# EAGLE design untitled (EAGLE 6.3)
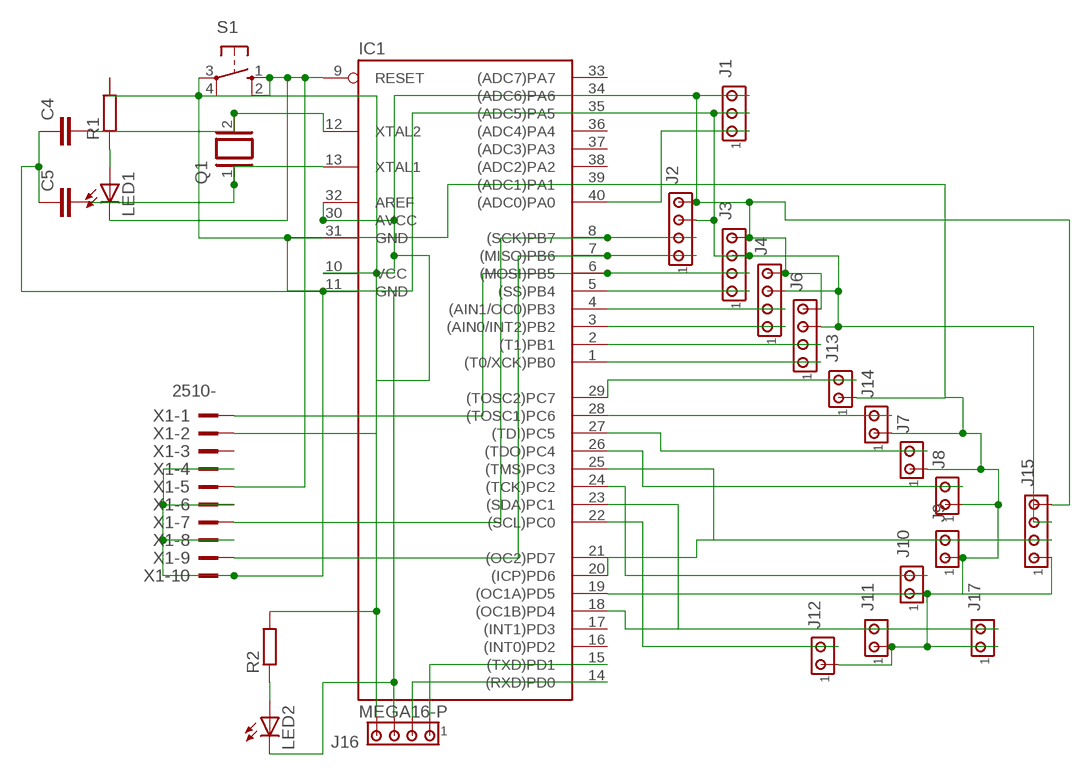
[diagram p0: schematic, sheet 1]

## Parts
C4  C2.5/2  [C2.5-2]
C5  C2.5/2  [C2.5-2]
IC1  MEGA16-P  [DIL40]
J1  MTA03-100  [10X03MTA]
J2  MTA04-100  [10X04MTA]
J3  MTA04-100  [10X04MTA]
J4  MTA04-100  [10X04MTA]
J6  MTA04-100  [10X04MTA]
J7  MTA02-100  [10X02MTA]
J8  MTA02-100  [10X02MTA]
J9  MTA02-100  [10X02MTA]
J10  MTA02-100  [10X02MTA]
J11  MTA02-100  [10X02MTA]
J12  MTA02-100  [10X02MTA]
J13  MTA02-100  [10X02MTA]
J14  MTA02-100  [10X02MTA]
J15  MTA04-100  [10X04MTA]
J16  MTA04-100  [10X04MTA]
J17  MTA02-100  [10X02MTA]
LED1  LEDSFH482  [SFH482]
LED2  LEDSFH482  [SFH482]
Q1  XTAL/S  [QS]
R1  R-EU_0207/10  [0207/10]
R2  R-EU_0207/10  [0207/10]
S1  10-XX  [B3F-10XX]
X1  2510-  [PAK100/2500-10]

## Nets
N$1: IC1.29((TOSC2)PC7) J13.2
N$2: IC1.9(RESET) LED1.K(C) S1.1(S) S1.2(S1) X1.5
N$3: IC1.40((ADC0)PA0) J1.1
N$4: IC1.1((T0/XCK)PB0) J6.1
N$5: IC1.2((T1)PB1) J6.2
N$6: IC1.3((AIN0/INT2)PB2) J4.1
N$7: IC1.4((AIN1/OC0)PB3) J4.2
N$8: IC1.5((SS)PB4) J3.1
N$9: IC1.6((MOSI)PB5) J3.2 X1.1
N$10: IC1.7((MISO)PB6) J2.1 X1.9
N$11: IC1.8((SCK)PB7) J2.2 X1.7
N$12: IC1.10(VCC) IC1.30(AVCC) IC1.32(AREF) J1.3 J2.4 J3.4 J4.4 J6.4 J15.4 J16.4 R1.2 R2.2 X1.2
N$14: IC1.28((TOSC1)PC6) J14.2
N$15: IC1.27((TDI)PC5) J7.2
N$16: IC1.26((TDO)PC4) J8.2
N$17: IC1.25((TMS)PC3) J9.2
N$18: IC1.24((TCK)PC2) J10.2
N$19: IC1.23((SDA)PC1) J11.2
N$20: IC1.22((SCL)PC0) J12.2
N$21: LED2.A R2.1
N$22: IC1.19((OC1A)PD5) J15.1
N$23: IC1.15((TXD)PD1) J16.1
N$26: IC1.20((ICP)PD6) J15.2
N$34: IC1.14((RXD)PD0) J16.2
N$39: LED1.A R1.1
N$46: C5.2 IC1.13(XTAL1) Q1.1
N$47: C4.2 IC1.12(XTAL2) Q1.2
N$48: C4.1 C5.1 IC1.11(GND) IC1.31(GND) J1.2 J2.3 J3.3 J4.3 J6.3 J7.1 J8.1 J9.1 J10.1 J11.1 J12.1 J13.1 J14.1 J15.3 J16.3 J17.1 LED2.K(C) S1.3(P) S1.4(P1) X1.4 X1.6 X1.8 X1.10
N$59: IC1.18((OC1B)PD4) J17.2
Unconnected: IC1.16((INT0)PD2) IC1.17((INT1)PD3) IC1.21((OC2)PD7) IC1.33((ADC7)PA7) IC1.34((ADC6)PA6) IC1.35((ADC5)PA5) IC1.36((ADC4)PA4) IC1.37((ADC3)PA3) IC1.38((ADC2)PA2) IC1.39((ADC1)PA1) X1.3

## Library data of the parts
C4 C5 = capacitor-wima:C: CAPACITOR naming: grid - package width
IC1 = atmel:MEGA16-P: MICROCONTROLLER 16 Kbytes FLASH 1 kbytes SRAM 512 bytes EEPROM USART 8-channel 10 bit ADC Source: avr.lbr; MPN: ATMEGA16-16PU; OC_FARNELL: 9171142; OC_NEWARK: 01M6885
J1 = con-amp:MTA03-100: AMP connector
J2-J4 J6 J15 J16 = con-amp:MTA04-100: AMP connector
J7-J14 J17 = con-amp:MTA02-100: AMP connector
LED1 LED2 = adafruit:LED: LED OSRAM: - CHIPLED LG R971, LG N971, LY N971, LG Q971, LY Q971, LO R971, LY R971 LH N974, LH R974 LS Q976, LO Q976, LY Q976 LO Q996 - Hyper CHIPLED LW Q18S LB Q993, LB Q99A, LB R99A - SideLED LS A670, LO A670, LY A670, LG A670, LP A670 LB A673, LV A673, LT A673, LW A673 LH A674 LY A675 LS A676, LA A676, LO A676, LY A676, LW A676 LS A679, LY A679, LG A679 - Hyper Micro SIDELED® LS Y876, LA Y876, LO Y876, LY Y876 LT Y87S - SmartLED LW L88C, LW L88S LB L89C, LB L89S, LG L890 LS L89K, LO L89K, LY L89K LS L896, LA L896, LO L896, LY L896 - TOPLED LS T670, LO T670, LY T670, LG T670, LP T670 LSG T670, LSP T670, LSY T670, LOP T670, LYG T670 LG T671, LOG T671, LSG T671 LB T673, LV T673, LT T673, LW T673 LH T674 LS T676, LA T676, LO T676, LY T676, LB T676, LH T676, LSB T676, LW T676 LB T67C, LV T67C, LT T67C, LS T67K, LO T67K, LY T67K, LW E67C LS E67B, LA E67B, LO E67B, LY E67B, LB E67C, LV E67C, LT E67C LW T67C LS T679, LY T679, LG T679 LS T770, LO T770, LY T770, LG T770, LP T770 LB T773, LV T773, LT T773, LW T773 LH T774 LS E675, LA E675, LY E675, LS T675 LS T776, LA T776, LO T776, LY T776, LB T776 LHGB T686 LT T68C, LB T68C - Hyper Mini TOPLED® LB M676 - Mini TOPLED Santana® LG M470 LS M47K, LO M47K, LY M47K Source: http://www.osram.convergy.de/
Q1 = special:XTAL/S: CRYSTAL
R1 R2 = rcl:R-EU_: RESISTOR, European symbol
S1 = switch-omron:10-XX: OMRON SWITCH; MPN: B3F-1000; OC_FARNELL: 176432; OC_NEWARK: 36M3542
X1 = con-3m:2510-: 3M (TM) Pak 100 4-Wall Header Source: 3M; MF: 3M; MPN: 2510-6002UB; OC_FARNELL: 9838244; OC_NEWARK: 46F4725

## Board
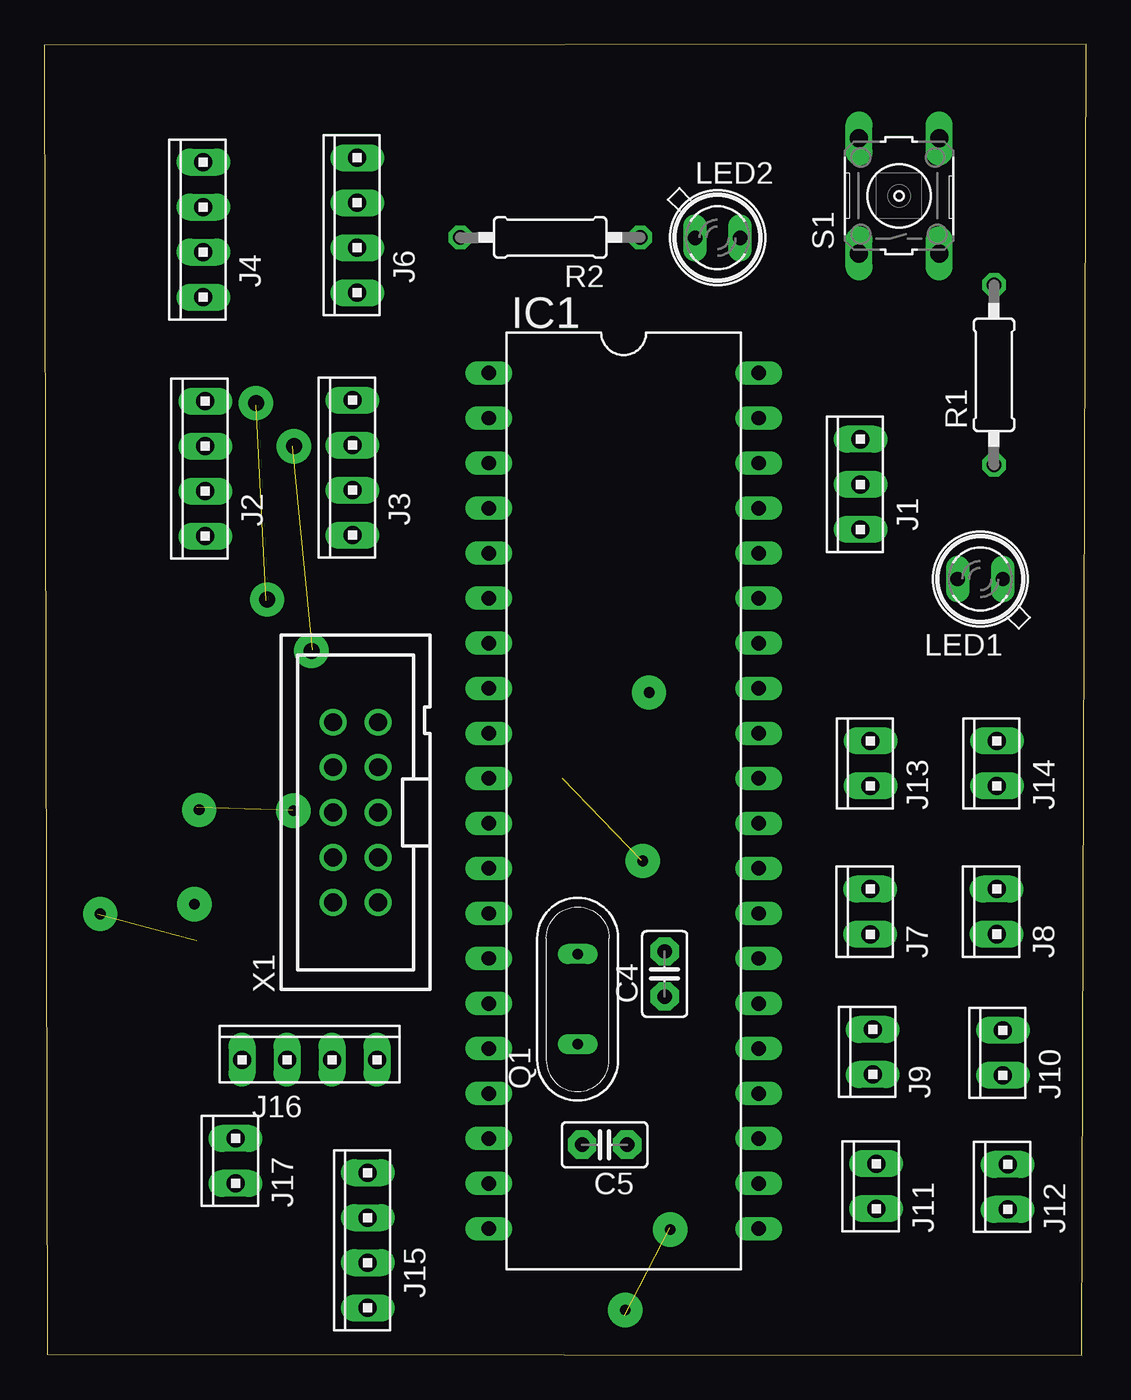
[diagram p1: board, top side]
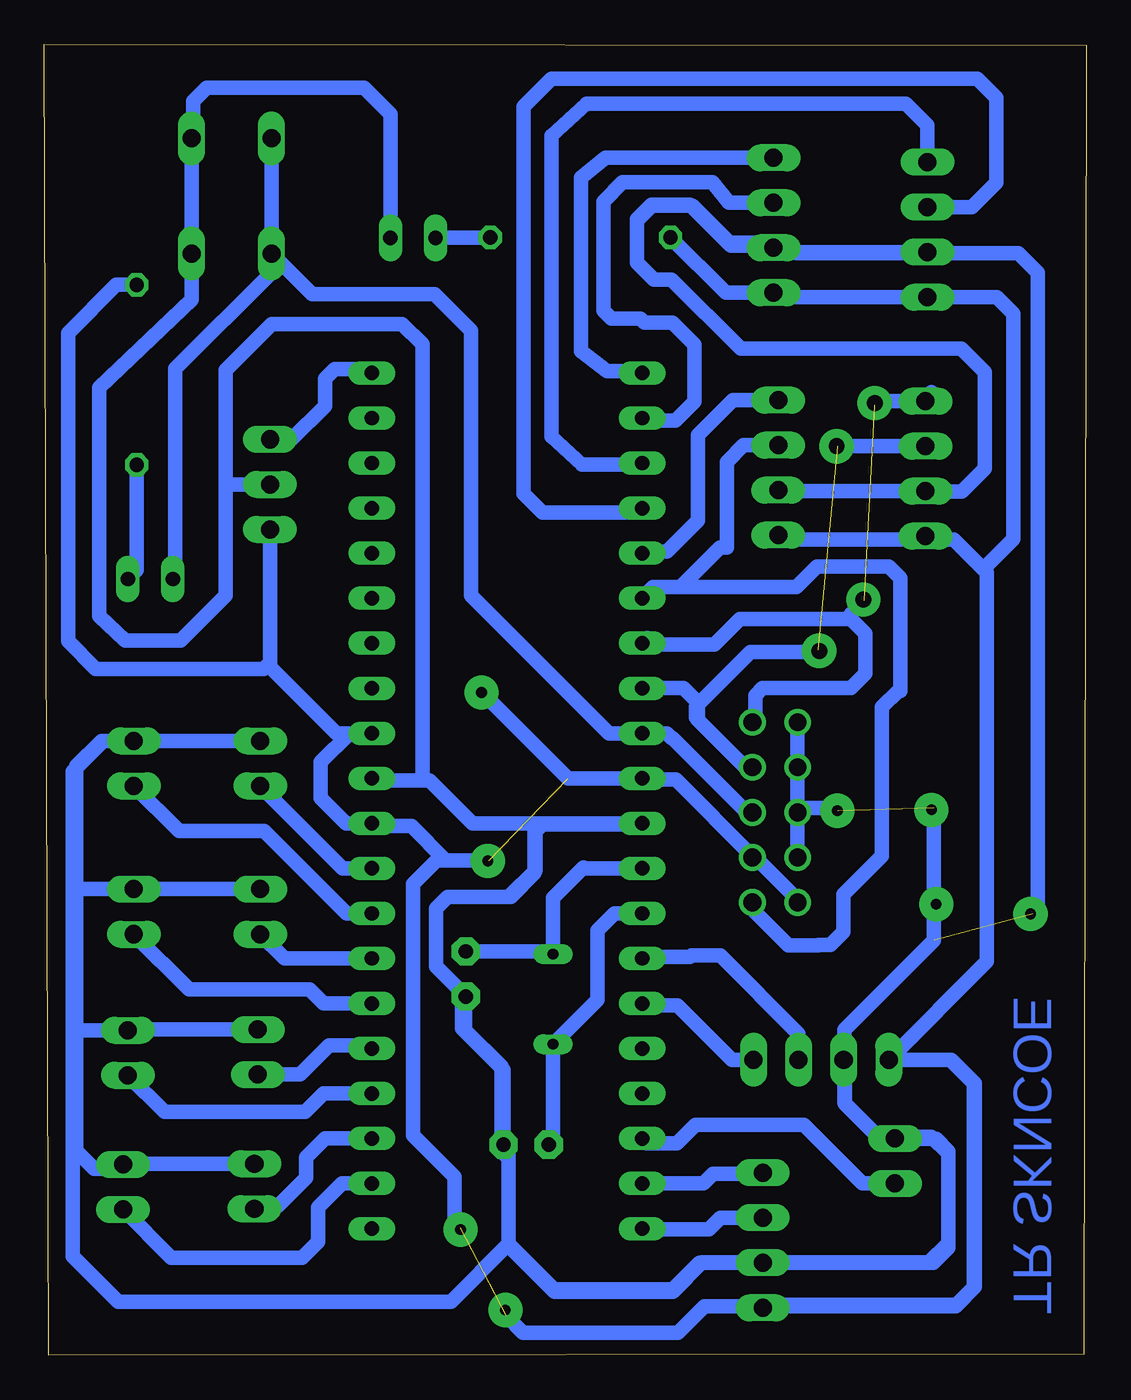
[diagram p2: board, bottom side, seen from below]

Size 58.78 x 73.94 mm. Coordinates in mm from the lower left corner, seen from the top.
Outline: 0.15,0.06 58.53,0 58.78,73.94 0,73.89 0.15,0.06
Copper layers (1*16): Top 0.035mm / dielectric 1.5mm / Bottom 0.035mm
Design rules "default": minimum track width 10mil, minimum drill 24mil, track to track 8mil, track to pad 8mil, pad to pad 8mil, via to via 8mil, smd to smd 8mil, copper to edge 40mil, drill to drill 8mil, minimum pad ring 10mil, minimum via ring 8mil, stop-mask expansion 4mil, vias tented up to drill 0mil, thermal gap 10mil

### Footprints (pad centres in the part's own frame; a part is rotated, then mirrored left to right if it is on the bottom)
C2.5-2 = drill 0.813 pad 1.6 octagon: 1 -1.27,0; 2 1.27,0
DIL40 = drill 0.813 long: 1 -24.13,-7.62; 2 -21.59,-7.62; 3 -19.05,-7.62; 4 -16.51,-7.62; 5 -13.97,-7.62; 6 -11.43,-7.62; 7 -8.89,-7.62; 8 -6.35,-7.62; 9 -3.81,-7.62; 10 -1.27,-7.62; 11 1.27,-7.62; 12 3.81,-7.62; 13 6.35,-7.62; 14 8.89,-7.62; 15 11.43,-7.62; 16 13.97,-7.62; 17 16.51,-7.62; 18 19.05,-7.62; 19 21.59,-7.62; 20 24.13,-7.62; 21 24.13,7.62; 22 21.59,7.62; 23 19.05,7.62; 24 16.51,7.62; 25 13.97,7.62; 26 11.43,7.62; 27 8.89,7.62; 28 6.35,7.62; 29 3.81,7.62; 30 1.27,7.62; 31 -1.27,7.62; 32 -3.81,7.62; 33 -6.35,7.62; 34 -8.89,7.62; 35 -11.43,7.62; 36 -13.97,7.62; 37 -16.51,7.62; 38 -19.05,7.62; 39 -21.59,7.62; 40 -24.13,7.62
10X03MTA = drill 1.016 long: 1 2.54,0; 2 0,0; 3 -2.54,0
10X04MTA = drill 1.016 long: 1 3.81,0; 2 1.27,0; 3 -1.27,0; 4 -3.81,0
10X02MTA = drill 1.016 long: 1 1.27,0; 2 -1.27,0
SFH482 = drill 0.813 long: A -1.27,0; K 1.27,0
QS = drill 0.61 long: 1 -2.54,0; 2 2.54,0
0207/10 = drill 0.813 octagon: 1 -5.08,0; 2 5.08,0
B3F-10XX = drill 1.016 long: 1 -3.251,2.261; 2 3.251,2.261; 3 -3.251,-2.261; 4 3.251,-2.261
PAK100/2500-10 = drill 1 pad 1.422: 1 -5.08,-1.27; 2 -5.08,1.27; 3 -2.54,-1.27; 4 -2.54,1.27; 5 0,-1.27; 6 0,1.27; 7 2.54,-1.27; 8 2.54,1.27; 9 5.08,-1.27; 10 5.08,1.27

### Placement (x,y rotation side)
C4  35,21.51 90 top
C5  31.61,11.87 180 top
IC1  32.68,31.27 270 top
J1  46.05,49.12 90 top
J2  9.08,50 90 top
J3  17.38,50.06 90 top
J4  8.96,63.49 90 top
J6  17.65,63.73 90 top
J7  46.59,25.02 90 top
J8  53.73,25.02 90 top
J9  46.74,17.1 90 top
J10  54.07,17.06 90 top
J11  46.93,9.53 90 top
J12  54.34,9.49 90 top
J13  46.61,33.39 90 top
J14  53.74,33.39 90 top
J15  18.25,6.48 90 top
J16  14.96,16.67 0 top
J17  10.79,10.96 90 top
LED1  52.8,43.78 180 top
LED2  37.98,63.03 0 top
Q1  30.09,20.08 90 top
R1  53.57,55.3 90 top
R2  28.54,63.05 180 top
S1  48.22,65.4 90 top
X1  17.56,30.62 90 top

### Tracks (layer width: path | path; a pad name or v marks a point on that pad's centre or on a via)
N$1
  Bottom 0.813: IC1.29 41.95,27.46 J13.2
N$2
  Bottom 0.813: X1.5 19.15,30.62 23.35,34.82 23.4,34.82 23.66,35.07 IC1.9 26.94,35.08 34.7,42.84 34.7,57.79 36.77,59.86 43.67,59.86 S1.1 | S1.1 45.96,61.07 51.39,55.64 51.39,43.92 LED1.K | S1.2 S1.1
N$3
  Bottom 0.813: J1.1 44.84,51.66 42.95,53.55 42.95,55.08 42.39,55.63 40.54,55.63 IC1.40
N$4
  Bottom 0.813: J6.1 27.13,67.54 28.51,66.43 28.51,56.63 27.05,55.51 25.18,55.51 IC1.1
N$5
  Bottom 0.813: J6.2 20.15,65 21.08,66.17 26.15,66.17 27.25,65.07 27.25,58.92 26.78,58.46 25.14,58.46 24.91,58.23 23.35,58.23 22.11,57 22.11,53.78 23.18,52.71 25.21,52.71 | 25.57,52.71 25.21,52.71 | 25.21,52.71 IC1.2
N$6
  Bottom 0.813: J4.1 8.96,69.38 10.18,70.59 28.2,70.59 30.17,68.78 30.17,51.81 28.45,50.24 25.14,50.24 IC1.3
N$7
  Bottom 0.813: J4.2 6.46,64.76 5.07,66.14 5.07,70.92 6.14,71.99 30.18,71.99 31.75,70.43 31.75,48.59 30.68,47.52 25.32,47.52 IC1.4
N$8
  Bottom 0.813: J3.1 19.93,53.87 21.91,51.89 21.91,47.08 23.67,45.32 24.98,45.32 IC1.5
N$9
  Bottom 0.813: J3.2 19.33,51.33 20.28,50.38 20.28,45.57 20.65,45.57 22.9,43.32 | 22.9,43.32 16.35,43.32 15.19,44.48 11.13,44.48 10.49,43.85 10.49,37.47 10.61,37.47 11.53,36.55 11.53,28.16 13.7,25.98 13.7,23.88 14.43,23.16 15.11,23.16 15.15,23.12 16.81,23.12 18.83,25.14 X1.1 | 22.9,43.32 24.44,43.32 IC1.6
N$10  (1 unrouted)
  Bottom 0.813: 24.77,40.46 IC1.7 24.98,40.08 20.99,40.08 19.54,41.53 13.27,41.53 | 8.74,54.31 9.08,53.98 J2.1 11.71,53.81 11.94,53.59 | 13.27,41.53 12.46,40.71 12.46,38.46 13.29,37.63 18.27,37.63 18.68,37.22 18.68,35.85 X1.9 | 13.27,41.53 13.27,41.82 12.52,42.57
N$11  (1 unrouted)
  Bottom 0.813: 21.91,35.84 19.23,33.16 X1.7 | 21.91,35.84 21.91,36.83 22.72,37.64 25.04,37.64 IC1.8 | 21.91,35.84 22.03,35.96 22.03,36.6 18.96,39.67 15.24,39.67 15.13,39.79 | J2.2 14.02,51.27 14.03,51.27
N$12  (2 unrouted)
  Bottom 0.813: 40.38,35.16 IC1.32 | 53.82,60.38 R1.2 54.72,60.38 57.44,57.67 57.44,40.27 55.89,38.72 46.41,38.72 46.05,39.08 | R2.2 20.34,59.92 J6.4 17.41,59.68 J4.4 5.04,59.68 4.1,58.75 4.1,46.05 5.81,44.35 | 9.26,46.01 J2.4 | 9.26,46.01 17.14,46.01 J3.4 | X1.2 16.29,25.7 18.7,28.11 18.8,28.11 23.16,32.47 24.99,32.47 IC1.10 29.24,32.54 34.08,37.38 | J1.3 46.05,39.08 | 46.05,39.08 46.05,38.83 42.3,35.08 IC1.32 | IC1.32 41.56,35.08 43.18,33.46 43.18,31.44 41.74,30 IC1.30 40.16,29.85 38.08,29.85 36.14,27.92 | 36.14,27.92 33.68,27.92 | 36.14,27.92 36.65,27.92 37.99,26.57 37.99,12.41 35.63,10.05 35.63,7.52 35.3,7.19 | J16.4 7.67,16.67 6.35,15.34 6.35,3.83 7.33,2.85 18.07,2.85 J15.4 | 9.26,46.01 7.47,46.01 5.81,44.35 | 5.81,44.35 5.6,44.14 5.6,22.22 J16.4 | J16.4 7.62,16.67 6.28,15.33 6.28,3.86 7.37,2.77 21.54,2.77 23.05,1.27 31.76,1.27 32.72,2.22
N$13  (via drill 0.6 pad 1.93)
  other vias: 34.12,37.38
N$14
  Bottom 0.813: IC1.28 41.73,24.92 46.37,29.57 51.19,29.57 J14.2
N$15
  Bottom 0.813: IC1.27 45.23,22.38 J7.2
N$16
  Bottom 0.813: IC1.26 43.03,19.84 43.81,20.62 50.6,20.62 J8.2
N$17
  Bottom 0.813: J9.2 44.36,15.83 42.71,17.48 40.49,17.48 IC1.25
N$18
  Bottom 0.813: IC1.24 43.03,14.76 44.07,13.72 52,13.72 J10.2
N$19
  Bottom 0.813: IC1.23 42.96,12.22 44.02,11.16 44.02,10 45.59,8.44 46.76,8.44 J11.2
N$20
  Bottom 0.813: IC1.22 41.99,9.68 43.34,8.33 43.34,6.39 44.23,5.51 51.63,5.51 J12.2
N$21
  Bottom 0.813: R2.1 36.7,63.05 LED2.A
N$22
  Bottom 0.813: IC1.19 21.61,9.68 21.05,10.24 18.31,10.24 J15.1
N$23
  Bottom 0.813: IC1.15 24.96,19.74 23.06,19.74 19.99,16.67 J16.1
N$24  (via drill 0.9 pad 1.93)
  other vias: 15.07,39.73
N$26
  Bottom 0.813: J15.2 20.64,7.75 21.3,7.1 25.02,7.1 IC1.20
N$27  (via drill 0.6 pad 1.93)
  other vias: 8.74,30.76
N$28  (via drill 0.6 pad 1.93)
  other vias: 8.46,25.44
N$29  (via drill 0.6 pad 1.93)
  other vias: 3.15,24.89
N$34
  Bottom 0.813: IC1.14 24.97,22.48 22.36,22.48 22.29,22.54 20.64,22.54 16.23,18.14 J16.2
N$36  (via drill 0.9 pad 1.93)
  other vias: 14.08,51.27
N$37  (via drill 0.9 pad 1.93)
  other vias: 12.58,42.63
N$38  (via drill 0.9 pad 1.93)
  other vias: 11.94,53.7
N$39
  Bottom 0.813: R1.1 53.57,44.28 LED1.A
N$46
  Bottom 0.813: IC1.13 26.62,24.92 27.59,23.95 27.59,20.05 Q1.1 30.09,12.12 C5.2
N$47
  Bottom 0.813: IC1.12 28.31,27.46 28.36,27.52 30.09,25.79 Q1.2 30.24,22.78 C4.2
N$48  (2 unrouted)
  Bottom 0.813: J7.1 J8.1 56.73,26.29 56.98,26.54 | J9.1 54.03,18.37 J10.1 56.68,18.33 56.98,18.03 | X1.10 X1.8 X1.6 X1.4 16.29,30.82 16.34,30.87 14.16,30.87 14.01,30.71 | 31.15,30 IC1.11 24.99,29.93 30.69,29.93 31.08,29.53 31.08,27.34 32.58,25.85 36.03,25.85 36.68,25.2 36.68,21.92 C4.1 35.21,20.02 35.21,18.43 32.88,16.09 C5.1 32.58,11.58 32.58,6.27 | 37.38,32.43 37.05,32.43 34.62,30 31.15,30 | 37.38,32.43 40.19,32.43 IC1.31 | J4.3 17.41,62.22 J6.3 17.94,62.75 20.14,62.75 22.22,64.84 24.5,64.84 25.35,63.99 | LED2.K 39.25,70.01 40.75,71.51 49.63,71.51 50.4,70.74 50.4,68.73 S1.4 S1.3 50.48,59.54 55.68,54.57 55.68,41.69 54.22,40.31 51.09,40.31 48.56,42.84 48.56,49.27 | 48.56,49.27 48.56,55.57 45.95,58.17 38.6,58.17 37.45,57.02 37.45,32.51 37.38,32.43 | J3.3 17.33,48.73 J2.3 7.03,48.73 5.73,50.02 5.73,55.46 7.06,56.78 19.5,56.78 23.4,60.68 24.4,60.68 25.35,61.63 25.35,63.99 | J1.2 48.41,49.12 48.56,49.27 | 31.15,30 31.13,29.98 31.13,27.2 32.46,25.86 35.77,25.86 | J13.1 J14.1 | J14.1 55.55,34.66 56.98,33.23 56.98,26.54 | 56.98,26.54 56.98,18.03 | 56.98,18.03 56.98,11.53 55.98,10.53 54.58,10.53 J12.1 54.31,10.8 J11.1 | J14.1 55.45,34.66 57.17,32.94 57.17,5.59 54.61,3.02 35.83,3.02 32.58,6.27 | J16.3 13.61,16.59 13.61,14.17 11.66,12.23 J17.1 10.75,12.19 8.46,12.19 7.78,11.51 7.78,11.37 | 32.58,6.27 30.04,3.73 23.32,3.73 21.83,5.21 J15.3 8.62,5.21 7.78,6.05 7.78,6.32 | 25.35,63.99 25.35,64.09 24.54,64.89 22.37,64.89 20.05,62.57 16.78,62.57 16.37,62.16 3.83,62.16 2.74,61.07 2.74,25.16 3.01,24.89 | 35.04,20.25 35.04,18.33 32.99,16.29 32.99,11.51 32.58,11.1 32.58,6.18 29.99,3.59 23.32,3.59 21.68,5.23 8.88,5.23 7.78,6.32
  Bottom 0.813: 7.78,6.32 7.78,11.37 | 7.78,11.37 8.74,12.33 11.73,12.33 13.64,14.24 13.64,18.35 8.6,23.39 8.6,30.9
N$49  (via drill 0.6 pad 1.93)
  other vias: 33.76,27.88
N$51  (via drill 0.6 pad 1.93)
  other vias: 14.05,30.71
N$53  (via drill 0.6 pad 1.93)
  other vias: 35.3,7.08
N$54  (via drill 0.6 pad 1.93)
  other vias: 32.77,2.55
N$59
  Bottom 0.813: J17.2 12.63,9.69 15.95,13 22.04,13 23.08,11.96 24.8,11.96 IC1.18

### Text on the board
Bottom: TR SKNCOE